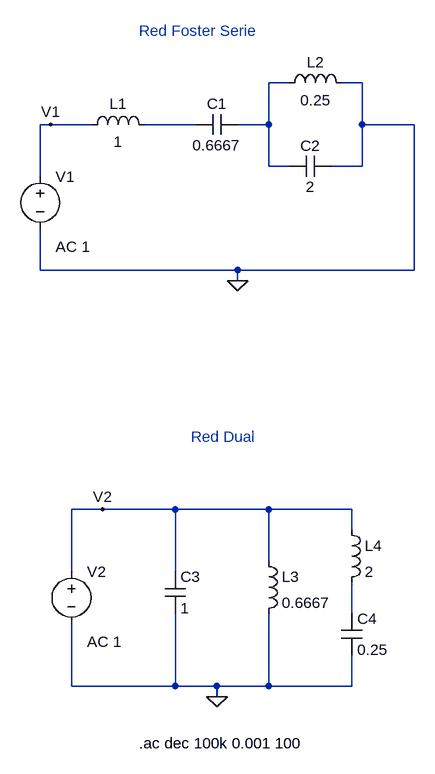
[diagram p0: schematic fosterSerie.asc]
fosterSerie.asc, the LTspice schematic file:
Version 4
SHEET 1 1676 680
WIRE 592 -544 560 -544
WIRE 704 -544 672 -544
WIRE 224 -480 208 -480
WIRE 288 -480 224 -480
WIRE 448 -480 368 -480
WIRE 560 -480 560 -544
WIRE 560 -480 512 -480
WIRE 704 -480 704 -544
WIRE 784 -480 704 -480
WIRE 560 -416 560 -480
WIRE 592 -416 560 -416
WIRE 704 -416 704 -480
WIRE 704 -416 656 -416
WIRE 208 -400 208 -480
WIRE 208 -256 208 -320
WIRE 512 -256 208 -256
WIRE 784 -256 784 -480
WIRE 784 -256 512 -256
WIRE 512 -240 512 -256
WIRE 304 112 256 112
WIRE 416 112 304 112
WIRE 560 112 416 112
WIRE 688 112 560 112
WIRE 688 144 688 112
WIRE 560 192 560 112
WIRE 256 208 256 112
WIRE 416 208 416 112
WIRE 688 272 688 224
WIRE 256 384 256 288
WIRE 416 384 416 272
WIRE 416 384 256 384
WIRE 480 384 416 384
WIRE 560 384 560 272
WIRE 560 384 480 384
WIRE 688 384 688 336
WIRE 688 384 560 384
WIRE 480 400 480 384
FLAG 512 -240 0
FLAG 224 -480 V1
FLAG 480 400 0
FLAG 304 112 V2
SYMBOL ind 272 -464 R270
WINDOW 0 32 56 VTop 2
WINDOW 3 5 56 VBottom 2
SYMATTR InstName L1
SYMATTR Value 1
SYMBOL cap 512 -496 R90
WINDOW 0 0 32 VBottom 2
WINDOW 3 32 32 VTop 2
SYMATTR InstName C1
SYMATTR Value 0.6667
SYMBOL ind 576 -528 R270
WINDOW 0 32 56 VTop 2
WINDOW 3 5 56 VBottom 2
SYMATTR InstName L2
SYMATTR Value 0.25
SYMBOL cap 592 -400 R270
WINDOW 0 32 32 VTop 2
WINDOW 3 0 32 VBottom 2
SYMATTR InstName C2
SYMATTR Value 2
SYMBOL voltage 208 -416 R0
WINDOW 123 24 124 Left 2
WINDOW 39 0 0 Left 0
SYMATTR InstName V1
SYMATTR Value ""
SYMATTR Value2 AC 1
SYMBOL cap 400 208 R0
SYMATTR InstName C3
SYMATTR Value 1
SYMBOL ind 544 176 R0
SYMATTR InstName L3
SYMATTR Value 0.6667
SYMBOL ind 672 128 R0
SYMATTR InstName L4
SYMATTR Value 2
SYMBOL cap 672 272 R0
SYMATTR InstName C4
SYMATTR Value 0.25
SYMBOL voltage 256 192 R0
WINDOW 123 24 124 Left 2
WINDOW 39 0 0 Left 0
SYMATTR InstName V2
SYMATTR Value ""
SYMATTR Value2 AC 1
TEXT 360 472 Left 2 !.ac dec 100k 0.001 100
TEXT 360 -624 Left 2 ;Red Foster Serie
TEXT 440 0 Left 2 ;Red Dual

The netlist it stands for:
* fosterSerie.asc
L1 V1 N002 1
C1 N001 N002 0.6667
L2 N001 0 0.25
C2 N001 0 2
V1 V1 0 AC 1
C3 V2 0 1
L3 V2 0 0.6667
L4 V2 N003 2
C4 N003 0 0.25
V2 V2 0 AC 1
.ac dec 100k 0.001 100
* Red Foster Serie
* Red Dual
.backanno
.end